# Altium project Electrode-Front-End.PrjPcb
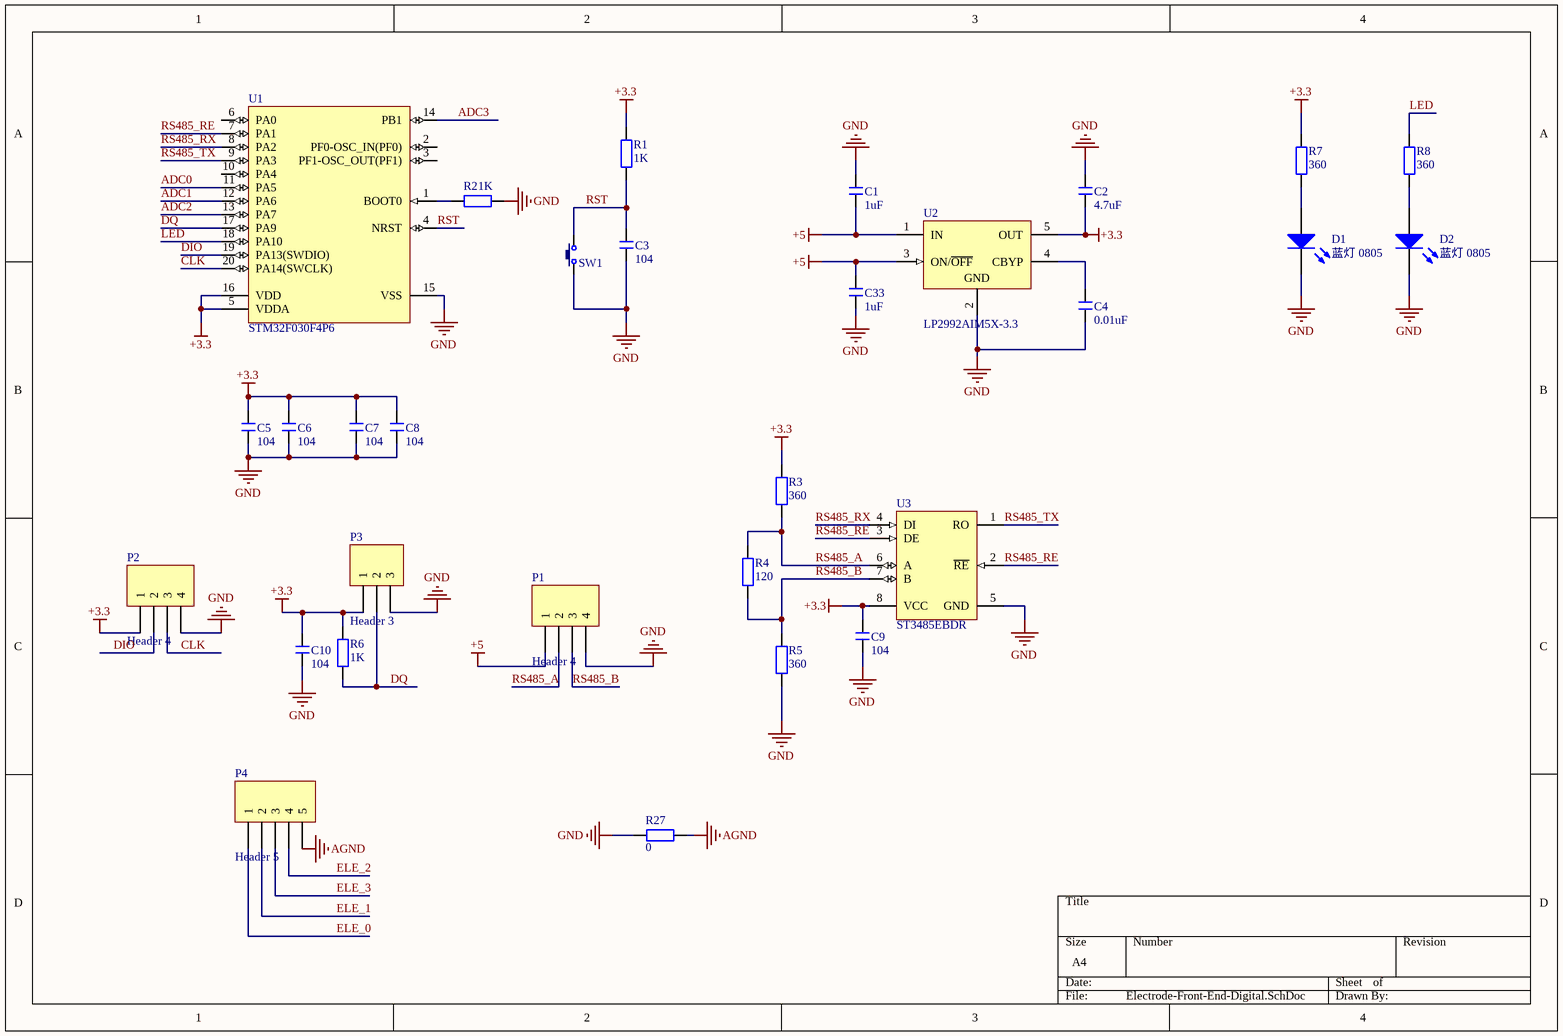
[diagram p0: Electrode-Front-End-Digital.SchDoc]
2 sheets, 76 parts. Net scope: global (net labels, ports and power ports of the same name join across sheets).
Board file: Electrode-Front-End.PcbDoc
Sheets:
  Electrode-Front-End-Digital.SchDoc
  Electrode-Front-End-Analog.SchDoc

## Sheet Electrode-Front-End-Digital.SchDoc
size A4; DocumentNumber: 1; SheetNumber: 1; SheetTotal: 2

### Parts
C1  1uF  [C 0603_L]
C2  4.7uF  [C 0603_L]
C3  104  [C 0603_L]
C4  0.01uF  [C 0603_L]
C5  104  [C 0603_L]
C6  104  [C 0603_L]
C7  104  [C 0603_L]
C8  104  [C 0603_L]
C9  104  [C 0603_L]
C10  104  [C 0603_L]
C33  1uF  [C 0603_L]
D1  蓝灯 0805  [0805_LED_S1]
D2  蓝灯 0805  [0805_LED_S1]
P1  Header 4  [HDR1X4]
P2  Header 4  [HDR1X4]
P3  Header 3  [HDR1X3]
P4  Header 5  [HDR1X5]
R1  1K  [R 0603_L]
R2  1K  [R 0603_L]
R3  360  [R 0603_L]
R4  120  [R 0603_L]
R5  360  [R 0603_L]
R6  1K  [R 0603_L]
R7  360  [R 0603_L]
R8  360  [R 0603_L]
R27  0  [R 0603_L]
SW1  3x6x5  [TSW SMD-3*6*2.5]  (value not drawn)
U1  STM32F030F4P6  [STM-TSSOP20_L]
U2  LP2992AIM5X-3.3  [MF05A_N]
U3  ST3485EBDR  [STM-SO-8_C_L]

### Nets
+3.3: C2.1 C5.2 C6.2 C7.2 C8.2 C9.2 C10.2 P2.1 P3.1 R1.2 R3.2 R6.2 R7.2 U1.5(VDDA) U1.16(VDD) U2.5(OUT) U3.8(VCC)
+5: C1.1 C33.2 P1.1 U2.1(IN) U2.3(ON/~{OFF})
AGND: P4.5 R27.2
GND: C1.2 C2.2 C3.1 C4.2 C5.1 C6.1 C7.1 C8.1 C9.1 C10.1 C33.1 D1.K D2.K P1.4 P2.4 P3.3 R2.2 R5.1 R27.1 SW1.1 U1.15(VSS) U2.2(GND) U3.5(GND)
ADC0: U1.11(PA5)
ADC1: U1.12(PA6)
ADC2: U1.13(PA7)
ADC3: U1.14(PB1)
CLK: P2.3 U1.20(PA14(SWCLK))
DIO: P2.2 U1.19(PA13(SWDIO))
DQ: P3.2 R6.1 U1.17(PA9)
ELE_0: P4.1
ELE_1: P4.2
ELE_2: P4.4
ELE_3: P4.3
LED: R8.2 U1.18(PA10)
RS485_A: P1.2 R3.1 R4.2 U3.6(A)
RS485_B: P1.3 R4.1 R5.2 U3.7(B)
RS485_RE: U1.7(PA1) U3.2(~{RE}) U3.3(DE)
RS485_RX: U1.8(PA2) U3.4(DI)
RS485_TX: U1.9(PA3) U3.1(RO)
RST: C3.2 R1.1 SW1.2 U1.4(NRST)
NetC4_1: C4.1 U2.4(CBYP)
NetD1_A: D1.A R7.1
NetD2_A: D2.A R8.1
NetR2_1: R2.1 U1.1(BOOT0)

Not connected (* = marked no-connect by the designer): U1 2(PF0-OSC_IN(PF0)) 3(PF1-OSC_OUT(PF1)) 6(PA0) 10(PA4)

### Library data of the parts
C1-C10 C33 = C: 无极性贴片电容; 材质: X7R; BOM名称: 无极性贴片电容
D1 D2 = 0805 蓝灯: 发光二极管; ComponentLink1Description: 供应商链接; ComponentLink1URL: http://www.szlcsc.com/product/details_2666.html; Package: 0805; Supplier: LC; SuppliersPartNumber: C2293
P1 P2 = Header 4: Header, 4-Pin; LatestRevisionDate: 17-Jul-2002; LatestRevisionNote: Re-released for DXP Platform.; Publisher: Altium Limited
P3 = Header 3: Header, 3-Pin; LatestRevisionDate: 17-Jul-2002; LatestRevisionNote: Re-released for DXP Platform.; Publisher: Altium Limited
P4 = Header 5: Header, 5-Pin; LatestRevisionDate: 17-Jul-2002; LatestRevisionNote: Re-released for DXP Platform.; Publisher: Altium Limited
R1-R8 R27 = R: 贴片电阻; BOM名称: 贴片电阻
SW1 = TSW 3x6: 3x6轻触开关; BOM名称: 3x6轻触开关
U1 = CMP-0304-00039-2: ARM Cortex-M0 32-bit MCU, 16 KB Flash, 4 KB Internal RAM, 15 I/Os, 20-pin TSSOP, -40 to 85 degC, Tube; I/Os (High Current): 15; FLASH Size (Prog) (kB): 16; Internal RAM Size (kB): 4; Supply Voltage(Vcc) min (V): 2.4; Operating Frequency(F) (Processor speed) (MHz): 48; ComponentLink2URL: http://www.st.com/st-web-ui/static/active/en/resource/technical/document/datasheet/DM00088500.pdf; Core: ARM Cortex-M0; ComponentLink2Description: Datasheet; PackageDescription: 20-Pin Thin Shrink Small Outline Package, 6.5 x 4.4 mm Body, 0.65 mm Pitch; Mounting Technology: Surface Mount; ComponentLink1URL: http://www.st.com/web/en/home.html; PackageVersion: Rev. 1, 11/2012; ComponentLink3Description: Package Specification; PartNumber: STM32F030F4P6; ComponentLink3URL: http://www.st.com/st-web-ui/static/active/en/resource/technical/document/datasheet/DM00065136.pdf; DatasheetVersion: Rev. 1; PackageReference: TSSOP20; ComponentLink1Description: Manufacturer URL; Packing: Tube
U2 = CMP-0062-02134-2: Micropower 250 mA Low-Noise Ultra Low-Dropout Regulator, 5-pin SOT-23; Manufacturer: National Semiconductor; PackageTopMarking: LFEA*XTT; PowerWise: N; CompType: LDO IC; PinCount: 5; PackageReference: MF05A; ComponentLink1URL: http://www.national.com/ds/LP/LP2992.pdf; RevisionNote: Component URLs added; ComponentLink1Description: LP2992 Datasheet; ComponentLink3Description: MF05A Package Page; ComponentLink2URL: http://www.national.com/pf/LP/LP2992.html; PackageDescription: Molded SOT-23, .115 x .063 x .040 in Body, 5 Lead, .0375 in Pitch; RoHS: N; ComponentLink2Description: LP2992 Web Page; DatasheetVersion: May-2005; ComponentLink3URL: http://www.national.com/packaging/folders/mf05a.html; PackageVersion: revD, Aug-2008
U3 = CMP-2000-07158-1: 15 KV ESD Protected, Up to 12 Mbps RS-485/RS-422 Transceiver, 3.3 V, -40 to 85 degC, 8-Pin SOIC (SO-8), RoHS, Tape and Reel; Manufacturer: STMicroelectronics; Data Transmission Topology: Multidrop/Multipoint; Number of Receivers: 1; Single Supply Voltage (Typ): 3.3V; Power Supply Requirement: Single; Dual Supply Voltage (Min): NotRequiredV; Interface Circuit Standard 1: RS-422/RS-485; Transmitter Signal Type: Differential; Single Supply Voltage (Min): 3V; Supply Current: 2.2mA; DELETED: Compliant; Single Supply Voltage (Max): 3.6V; Rad Hardened: No; Data Rate: 15kbps; Package Description: 8-Pin Small Outline Integrated Circuit, Body 4.9 x 3.9 mm, Pitch 1.27 mm; Operating Temp Range: -40Cto85C; Package Reference: SO-8; Pin Count: 8; Dual Supply Voltage (Max): NotRequiredV; Number of Transmitters: 1; Receiver Signal Type: Differential; Dual Supply Voltage (Typ): NotRequiredV; Mounting Technology: SurfaceMount; Package Type: SOICN; Number of Transceivers: 1; Operating Temperature Classification: Industrial; Datasheet URL: http://www.produktinfo.conrad.com/datenblaetter/1100000-1199999/001185042-da-01-en-IC_TXRX_3_3V_RS485_ST3485EBDR_SOIC_8_STM.pdf; Datasheet Version: Rev. 6 , 12/2013; Mounting: SurfaceMount; Packaging: TapeandReel; Manufacturer URL: http://www.st.com/

## Sheet Electrode-Front-End-Analog.SchDoc
size A4; DocumentNumber: 2; SheetNumber: 2; SheetTotal: 2
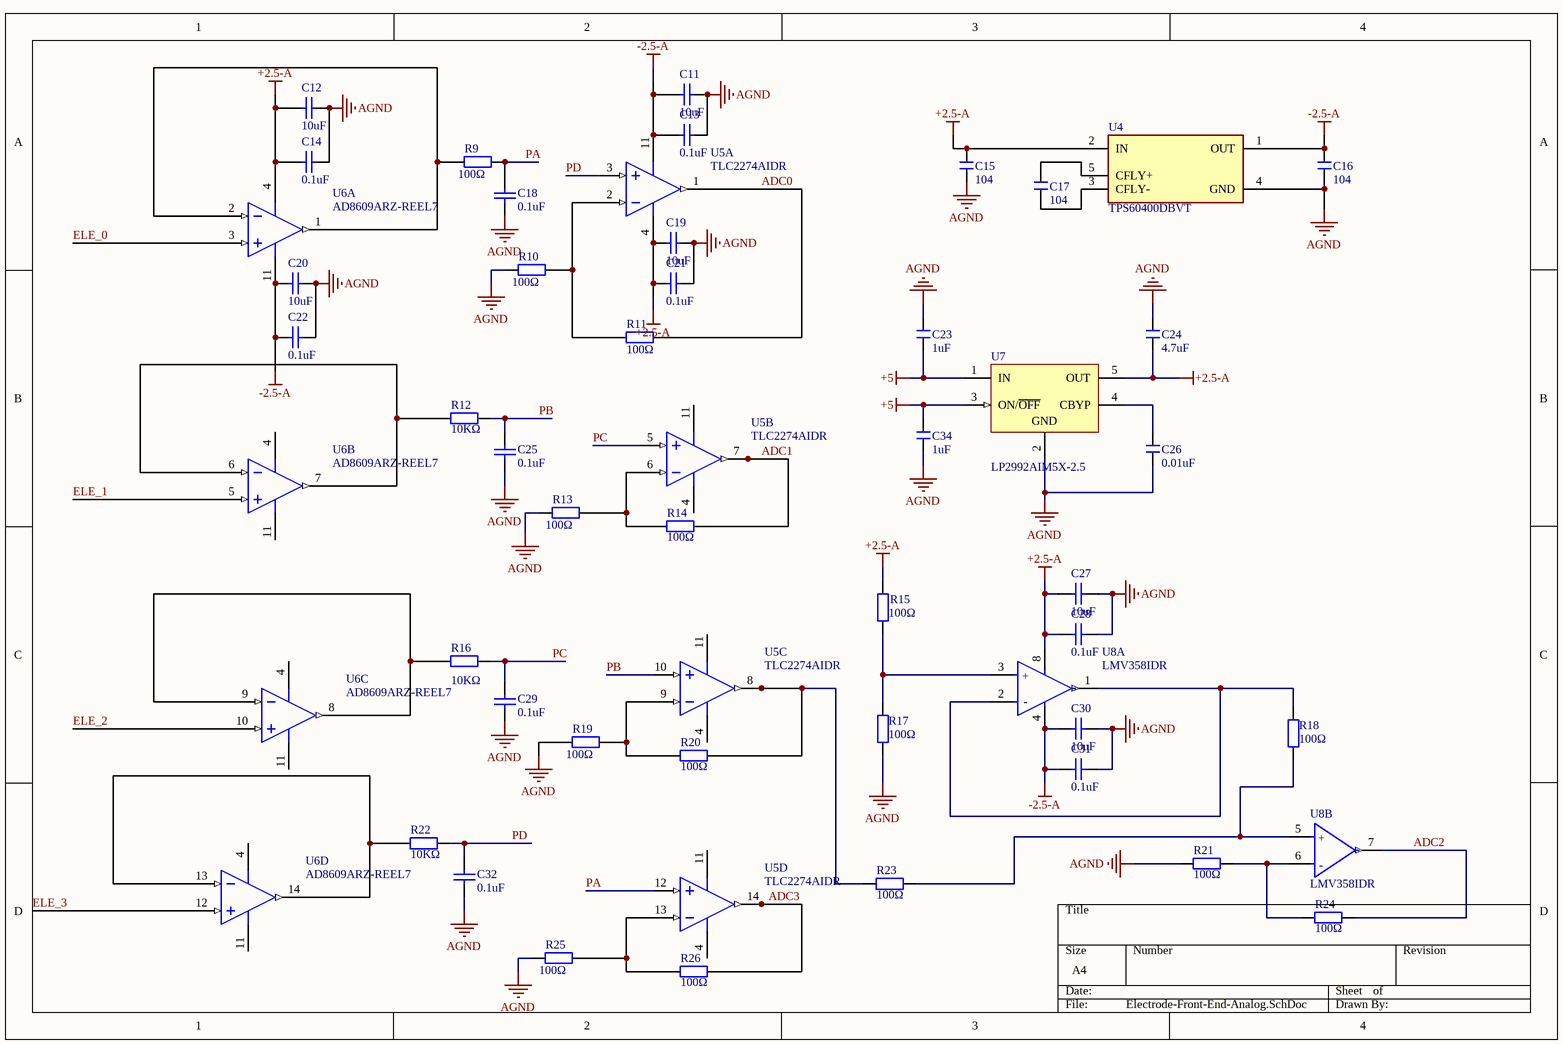
[diagram p1: Electrode-Front-End-Analog.SchDoc]

### Parts
C11  10uF  [C 0603_L]
C12  10uF  [C 0603_L]
C13  0.1uF  [C 0603_L]
C14  0.1uF  [C 0603_L]
C15  104  [C 0603_L]
C16  104  [C 0603_L]
C17  104  [C 0603_L]
C18  0.1uF  [C 0603_L]
C19  10uF  [C 0603_L]
C20  10uF  [C 0603_L]
C21  0.1uF  [C 0603_L]
C22  0.1uF  [C 0603_L]
C23  1uF  [C 0603_L]
C24  4.7uF  [C 0603_L]
C25  0.1uF  [C 0603_L]
C26  0.01uF  [C 0603_L]
C27  10uF  [C 0603_L]
C28  0.1uF  [C 0603_L]
C29  0.1uF  [C 0603_L]
C30  10uF  [C 0603_L]
C31  0.1uF  [C 0603_L]
C32  0.1uF  [C 0603_L]
C34  1uF  [C 0603_L]
R9  100Ω  [R 0603_L]
R10  100Ω  [R 0603_L]
R11  100Ω  [R 0603_L]
R12  10KΩ  [R 0603_L]
R13  100Ω  [R 0603_L]
R14  100Ω  [R 0603_L]
R15  100Ω  [R 0603_L]
R16  10KΩ  [R 0603_L]
R17  100Ω  [R 0603_L]
R18  100Ω  [R 0603_L]
R19  100Ω  [R 0603_L]
R20  100Ω  [R 0603_L]
R21  100Ω  [R 0603_L]
R22  10KΩ  [R 0603_L]
R23  100Ω  [R 0603_L]
R24  100Ω  [R 0603_L]
R25  100Ω  [R 0603_L]
R26  100Ω  [R 0603_L]
U4  TPS60400DBVT  [FP-DBV0005A-IPC_C]
U5  TLC2274AIDR  [D0014A_L]  (parts A,B,C,D of 4)
U6  AD8609ARZ-REEL7  [ADI-R-14_N]  (parts A,B,C,D of 4)
U7  LP2992AIM5X-2.5  [MF05A_M]
U8  LMV358IDR  [FP-D0008A-MFG]  (parts A,B of 2)

### Nets
+2.5-A: C12.1 C14.1 C15.2 C19.1 C21.1 C24.1 C27.1 C28.1 R15.2 U4.2(IN) U5.4(VDD+) U6.4(+V) U7.5(OUT) U8.8(VCC+)
+5: C23.1 C34.1 U7.1(IN) U7.3(ON/~{OFF})
-2.5-A: C11.1 C13.1 C16.2 C20.1 C22.1 C30.1 C31.1 U4.1(OUT) U5.11(VDD-) U6.11(-V) U8.4(GND)
AGND: C11.2 C12.2 C13.2 C14.2 C15.1 C16.1 C18.1 C19.2 C20.2 C21.2 C22.2 C23.2 C24.2 C25.1 C26.2 C27.2 C28.2 C29.1 C30.2 C31.2 C32.1 C34.2 R10.1 R13.1 R17.1 R19.1 R21.2 R25.1 U4.4(GND) U7.2(GND)
ADC0: R11.2 U5.1(OUT1)
ADC1: R14.2 U5.7(OUT2)
ADC2: R24.1 U8.7(2OUT)
ADC3: R26.2 U5.14(OUT4)
ELE_0: U6.3(+IN_A)
ELE_1: U6.5(+IN_B)
ELE_2: U6.10(+IN_C)
ELE_3: U6.12(+IN_D)
PA: C18.2 R9.2 U5.12(IN4+)
PB: C25.2 R12.2 U5.10(IN3+)
PC: C29.2 R16.2 U5.5(IN2+)
PD: C32.2 R22.2 U5.3(IN1+)
NetC17_1: C17.1 U4.3(CFLY-)
NetC17_2: C17.2 U4.5(CFLY+)
NetC26_1: C26.1 U7.4(CBYP)
NetR9_1: R9.1 U6.1(OUT_A) U6.2(-IN_A)
NetR10_2: R10.2 R11.1 U5.2(IN1-)
NetR12_1: R12.1 U6.6(-IN_B) U6.7(OUT_B)
NetR13_2: R13.2 R14.1 U5.6(IN2-)
NetR15_1: R15.1 R17.2 U8.3(1IN+)
NetR16_1: R16.1 U6.8(OUT_C) U6.9(-IN_C)
NetR18_1: R18.1 R23.1 U8.5(2IN+)
NetR18_2: R18.2 U8.1(OUT) U8.2(1IN-)
NetR19_2: R19.2 R20.1 U5.9(IN3-)
NetR20_2: R20.2 R23.2 U5.8(OUT3)
NetR21_1: R21.1 R24.2 U8.6(2IN-)
NetR22_1: R22.1 U6.13(-IN_D) U6.14(OUT_D)
NetR25_2: R25.2 R26.1 U5.13(IN4-)

### Notes on the sheet
- (in symbol CMP-04895-000136-1, part A) +; -
- (in symbol CMP-04895-000136-1, part B) +; -

### Library data of the parts
C11 C12 C19 C20 C27 C30 = 0603 10uF (106) 10% 10V: 贴片电容; ComponentLink1Description: 供应商链接; ComponentLink1URL: http://www.szlcsc.com/product/details_20411.html; Package: 0603; Supplier: LC; SuppliersPartNumber: C19702
C13 C14 C18 C21 C22 C25 C28 C29 C31 C32 = 0603 100nF (104) 10% 50V: 贴片电容; ComponentLink1Description: 供应商链接; ComponentLink1URL: http://www.szlcsc.com/product/details_15331.html; Package: 0603; Supplier: LC; SuppliersPartNumber: C14663
C15-C17 C23 C24 C26 C34 = C: 无极性贴片电容; 材质: X7R; BOM名称: 无极性贴片电容
R9-R26 = 0603 100Ω (1000) 1%: 贴片电阻; ComponentLink1Description: 供应商链接; ComponentLink1URL: http://www.szlcsc.com/product/details_23502.html; Package: 0603; Supplier: LC; SuppliersPartNumber: C22775
U4 = CMP-0391-00017-3: IC REG CHARG PUMP INV 60MA SOT23; Logic Function: Inverting; Frequency: 250kHz; Max Output Voltage: -5.25V; Max Input Voltage: 5.25V; Operating Supply Current: 125uA; Min Supply Voltage: 1.8V; Current Rating: 60A; Output Power: 437mW; Synchronous Rectifier: No; Number of Outputs: 1; Output Type: Adjustable; Min Output Voltage: -1.6V; Case/Package: SOT-23; Width: 1.6mm; Max Operating Temperature: 85°C; Termination: SMD/SMT; Height: 1.15mm; Max Output Current: 60mA; Radiation Hardening: No; Min Operating Temperature: -40°C; Output Voltage: -5.25V; Switching Frequency: 250kHz; Max Supply Voltage: 5.25V; Contact Plating: Gold; Lead Free: Lead Free; Package Quantity: 1; Min Input Voltage: 1.8V; Length: 2.9mm; Quiescent Current: 125uA; Weight: 0.000459oz; Packaging: Tape and Reel; Number of Pins: 5; Output Current: 60mA; REACH SVHC: No SVHC
U5 = CMP-0272-01921-3: Advanced LinCMOS(TM) Rail-to-Rail Quad Operational Amplifier, 4.4 to 16 V, -40 to 125 degC, 14-pin SOIC (D14), Green (RoHS & no Sb/Br); Manufacturer: Texas Instruments; Vio (25C)(Max)(mV): 0.95; Slew Rate(Typ)(V/us): 3.6; Total Supply Voltage(Max)(+5V is 5, +/-5V is 10): 16; GBW(Typ)(MHz): 2.18; CMRR(Min)(dB): 70; Packing: LARGE T&R; Sub Family: Low Noise Amp (<=10nV/rtHz), Precision Amplifier; Iq per channel(Max)(mA): 1.5; IIB(Max)(pA): 60; Offset Drift(Typ)(uV/C): 2; Total Supply Voltage(Min)(+5V is 5, +/-5V is 10): 4.4; Rating: Catalog; Number of Channels: 4; ComponentLink2URL: http://www.ti.com/lit/ds/symlink/tlc2274a.pdf; Eco-Plan: Green (RoHS & no Sb/Br); ComponentLink1URL: http://www.ti.com/; PackageDescription: 14-Pin Plastic Small Outline, Body 8.65 x 3.9 mm, Pitch 1.27 mm; ComponentLink3URL: http://www.ti.com/lit/ml/mpds177g/mpds177g.pdf; ComponentLink3Description: Package Specification; ComponentLink1Description: Manufacturer URL; DatasheetVersion: SLOS190G; PackageVersion: 4040047-5/M, 06/2011; Code_JEDEC: MS-012; Mounting Technology: Surface Mount; PartNumber: TLC2274AIDR; ComponentLink2Description: Datasheet; PackageReference: D0014A
U6 = CMP-0384-00468-2: Quad Channel Single-Supply Operation Operational Amplifier, 400 KHz BW, 100 mV/us SR, Industrial, 14-pin SOIC (R-14), Reel; Manufacturer: Analog Devices; Generic Part Number: AD8609; Amplifiers Per Package: 4; V Span Max: 5V; Iq/Amp: 40uA; Input Bias Current: 200fA; V Span Min: 1.8V; Small Signal Bandwidth: 400KHz; Input Offset Voltage: 12uV; PackageReference: R-14; ComponentLink2Description: Datasheet; RevisionNote: Reference Circuit URL fixed; Code_JEDEC: MS-012-AB; ComponentLink2URL: http://www.analog.com/static/imported-files/data_sheets/AD8603_8607_8609.pdf; ComponentLink1URL: http://www.analog.com/en/index.html; ComponentLink3URL: http://www.analog.com/static/imported-files/packages/PKG_PDF/SOIC_Narrow%20(R)/R_14.pdf; Mounting Technology: Surface Mount; Slew Rate: 100mV/us; ComponentLink3Description: Package Specification; ComponentLink4URL: http://www.analog.com/en/all-operational-amplifiers-op-amps/operational-amplifiers-op-amps/ad8609/products/product.html#product-recommendations; PackageVersion: 060606-A; PackageDescription: 14-Pin Standard Small Outline Package, Body 8.65 x 3.9 mm, Pitch 1.27 mm; ComponentLink1Description: Manufacturer URL; ComponentLink4Description: Reference Circuit; DatasheetVersion: Rev. C; PartNumber: AD8609ARZ-REEL7
U7 = CMP-0062-02121-2: Micropower 250 mA Low-Noise Ultra Low-Dropout Regulator, 5-pin SOT-23; Manufacturer: National Semiconductor; CompType: LDO IC; PowerWise: N; PackageTopMarking: LFDA*XTT; ComponentLink1URL: http://www.national.com/ds/LP/LP2992.pdf; PinCount: 5; DatasheetVersion: May-2005; RevisionNote: Component URLs added; RoHS: N; PackageReference: MF05A; ComponentLink1Description: LP2992 Datasheet; ComponentLink3URL: http://www.national.com/packaging/folders/mf05a.html; ComponentLink2Description: LP2992 Web Page; PackageVersion: revD, Aug-2008; ComponentLink2URL: http://www.national.com/pf/LP/LP2992.html; PackageDescription: Molded SOT-23, .115 x .063 x .040 in Body, 5 Lead, .0375 in Pitch; ComponentLink3Description: MF05A Package Page
U8 = CMP-04895-000136-1: IC OPAMP GP 2 CIRCUIT 8SOIC; Number of Elements: 2; Min Supply Voltage: 2.7V; Input Bias Current: 250nA; Output Current per Channel: 160mA; Bandwidth: 1MHz; Voltage Gain: 100dB; Input Offset Voltage (Vos): 7mV; Slew Rate: 1V/µs; Nominal Supply Current: 440uA; Power Supply Rejection Ratio (PSRR): 50dB; Max Supply Voltage: 5.5V; Operating Supply Current: 210uA; Lead Free: Lead Free; Length: 4.9mm; RoHS Compliant: Yes; REACH SVHC: No SVHC; Case/Package: SOIC; Height: 1.58mm; Number of Channels: 2; Number of Amplifiers: 2; Radiation Hardening: No; Number of Circuits: 2; Mount: Surface Mount; Contact Plating: Gold; Unity Gain Bandwidth Product: 1MHz; Min Operating Temperature: -40°C; Max Operating Temperature: 125°C; Width: 3.91mm; Gain Bandwidth Product: 1MHz; Number of Pins: 8; Packaging: Tape and Reel; Package Quantity: 2500; Output Current: 160mA; Common Mode Rejection Ratio: 50dB

## Nets that join several sheets
+5: Electrode-Front-End-Digital (5 pins), Electrode-Front-End-Analog (C23.1 C34.1 U7.1 U7.3)
AGND: Electrode-Front-End-Digital (P4.5 R27.2), Electrode-Front-End-Analog (30 pins)
ADC0: Electrode-Front-End-Digital (U1.11), Electrode-Front-End-Analog (R11.2 U5.1)
ADC1: Electrode-Front-End-Digital (U1.12), Electrode-Front-End-Analog (R14.2 U5.7)
ADC2: Electrode-Front-End-Digital (U1.13), Electrode-Front-End-Analog (R24.1 U8.7)
ADC3: Electrode-Front-End-Digital (U1.14), Electrode-Front-End-Analog (R26.2 U5.14)
ELE_0: Electrode-Front-End-Digital (P4.1), Electrode-Front-End-Analog (U6.3)
ELE_1: Electrode-Front-End-Digital (P4.2), Electrode-Front-End-Analog (U6.5)
ELE_2: Electrode-Front-End-Digital (P4.4), Electrode-Front-End-Analog (U6.10)
ELE_3: Electrode-Front-End-Digital (P4.3), Electrode-Front-End-Analog (U6.12)